# EAGLE design VA-Meter_Measure (EAGLE 7.1.0)
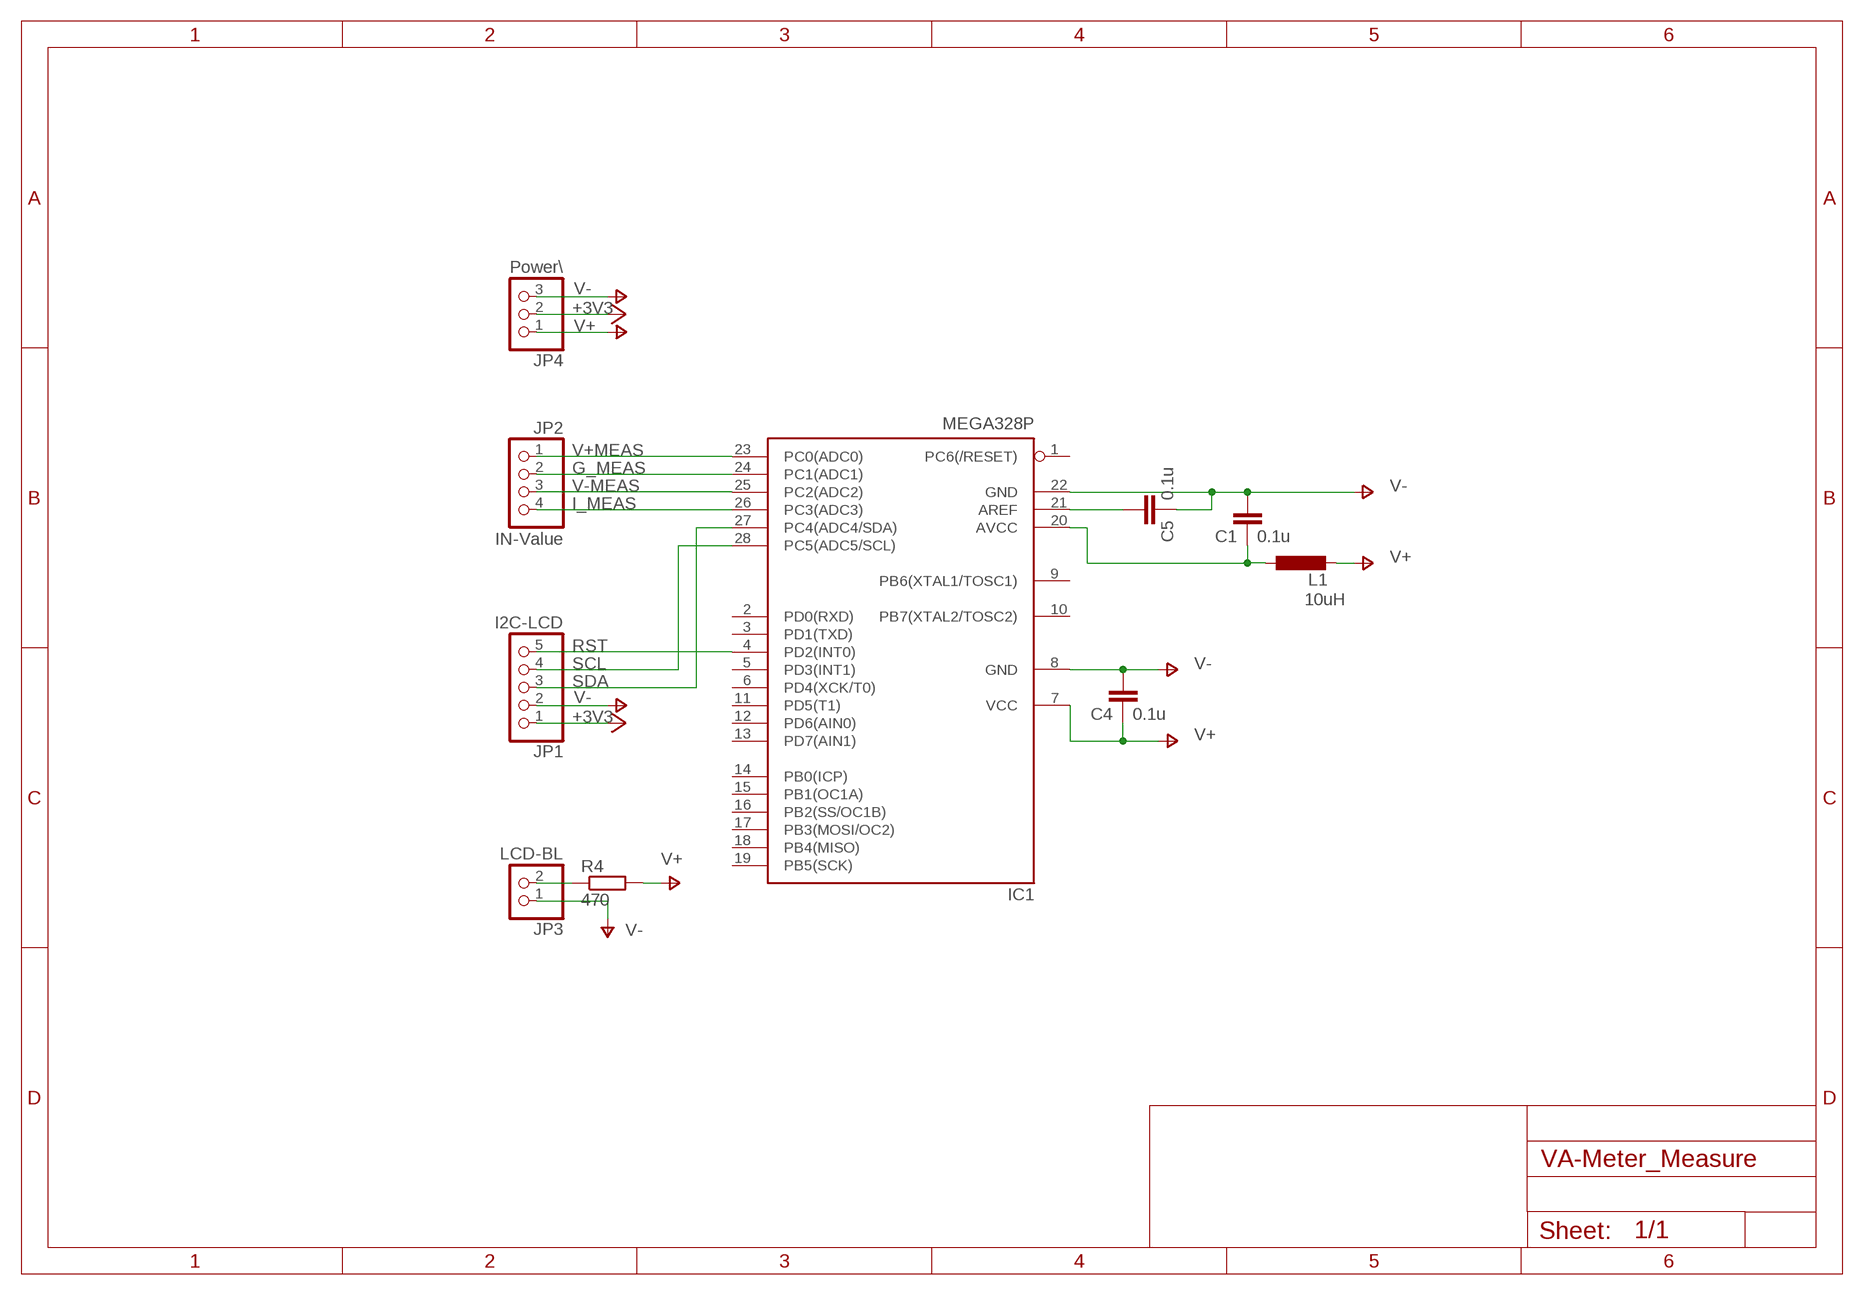
[diagram p0: schematic, sheet 1]

## Parts
C1  0.1u  C-EU050-024X044  [C050-024X044]
C4  0.1u  C-EU050-024X044  [C050-024X044]
C5  0.1u  C-EU050-024X044  [C050-024X044]
IC1  MEGA328P  [MEGA328P]
JP1  I2C-LCD  PINHD-1X5  [1X05]
JP2  IN-Value  PINHD-1X4  [1X04]
JP3  LCD-BL  PINHD-1X2  [1X02]
JP4  Power\  PINHD-1X3  [1X03]
L1  10uH  L-EU6000-XXX-RC  [6000-XXXX-RC]
R4  470  R-EU_0207/7  [0207/7]

## Nets
+3V3: JP1.1 JP4.2
G_MEAS: IC1.24(PC1(ADC1)) JP2.2
I_MEAS: IC1.26(PC3(ADC3)) JP2.4
N$2: JP3.2 R4.1
N$9: C5.2 IC1.21(AREF)
N$10: C1.1 IC1.20(AVCC) L1.1
RST: IC1.4(PD2(INT0)) JP1.5
SCL: IC1.28(PC5(ADC5/SCL)) JP1.4
SDA: IC1.27(PC4(ADC4/SDA)) JP1.3
V+: C4.1 IC1.7(VCC) JP4.1 L1.2 R4.2
V+MEAS: IC1.23(PC0(ADC0)) JP2.1
V-: C1.2 C4.2 C5.1 IC1.8(GND) IC1.22(GND) JP1.2 JP3.1 JP4.3
V-MEAS: IC1.25(PC2(ADC2)) JP2.3
Unconnected: IC1.1(PC6(/RESET)) IC1.2(PD0(RXD)) IC1.3(PD1(TXD)) IC1.5(PD3(INT1)) IC1.6(PD4(XCK/T0)) IC1.9(PB6(XTAL1/TOSC1)) IC1.10(PB7(XTAL2/TOSC2)) IC1.11(PD5(T1)) IC1.12(PD6(AIN0)) IC1.13(PD7(AIN1)) IC1.14(PB0(ICP)) IC1.15(PB1(OC1A)) IC1.16(PB2(SS/OC1B)) IC1.17(PB3(MOSI/OC2)) IC1.18(PB4(MISO)) IC1.19(PB5(SCK))

## Library data of the parts
C1 C4 C5 = rcl:C-EU: CAPACITOR, European symbol
IC1 = Mylib:MEGA328P: ATMega328P
JP1 = pinhead:PINHD-1X5: PIN HEADER
JP2 = pinhead:PINHD-1X4: PIN HEADER
JP3 = pinhead:PINHD-1X2: PIN HEADER
JP4 = pinhead:PINHD-1X3: PIN HEADER
L1 = rcl:L-EU: INDUCTOR, European symbol
R4 = rcl:R-EU_: RESISTOR, European symbol

## Board
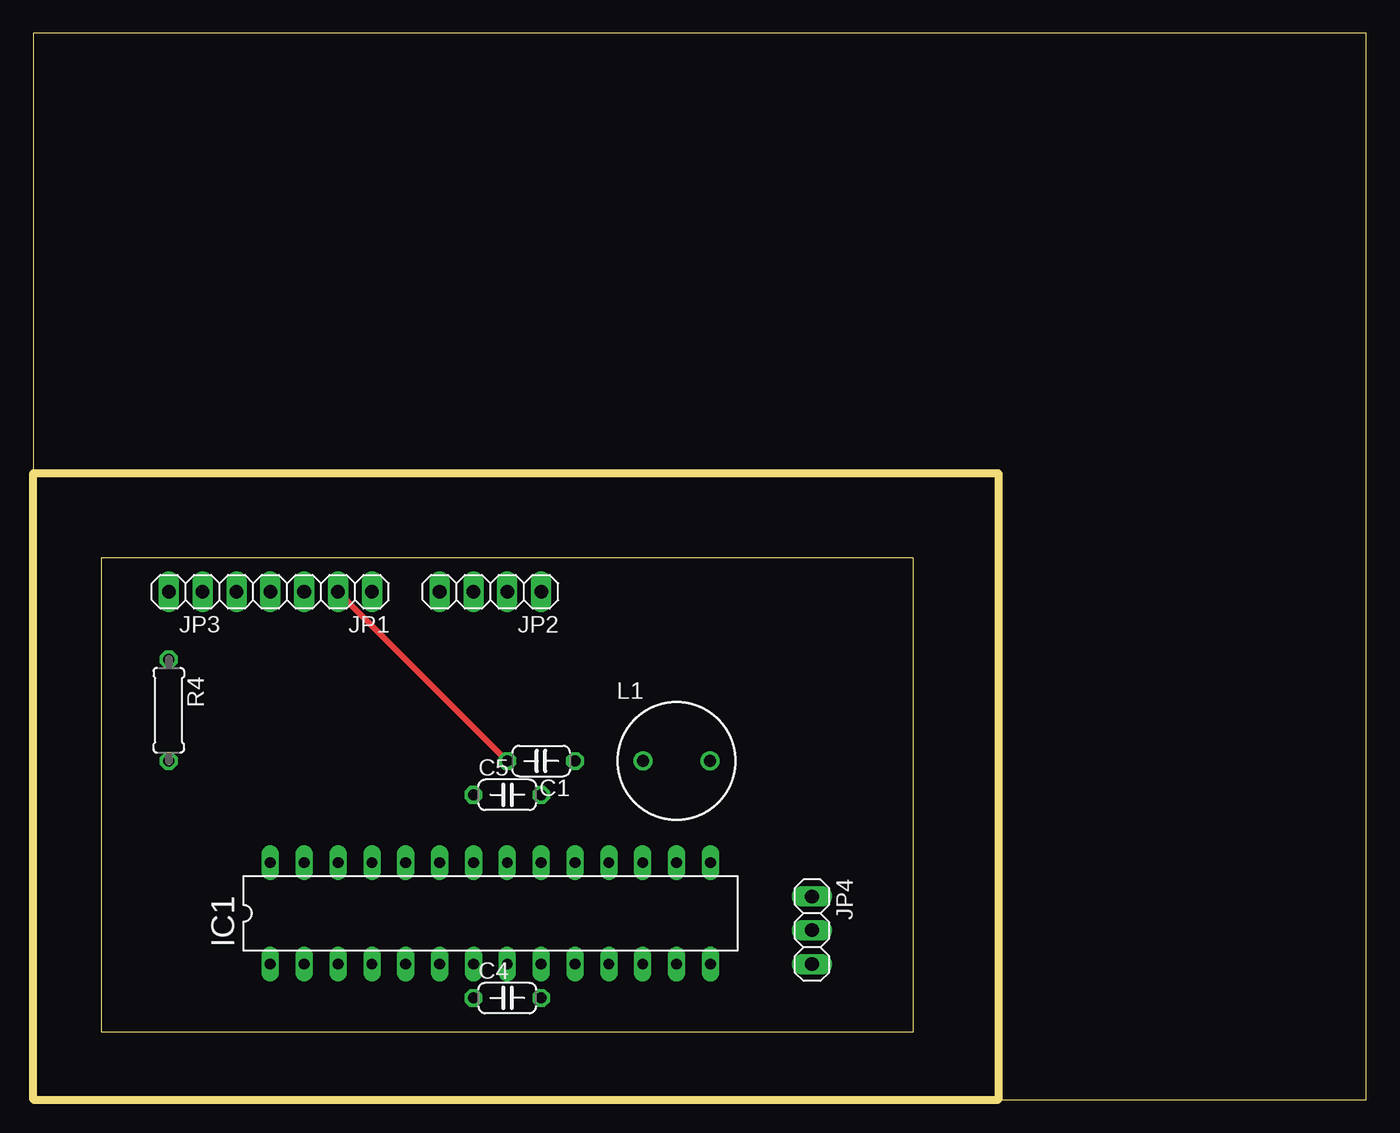
[diagram p1: board, top side]
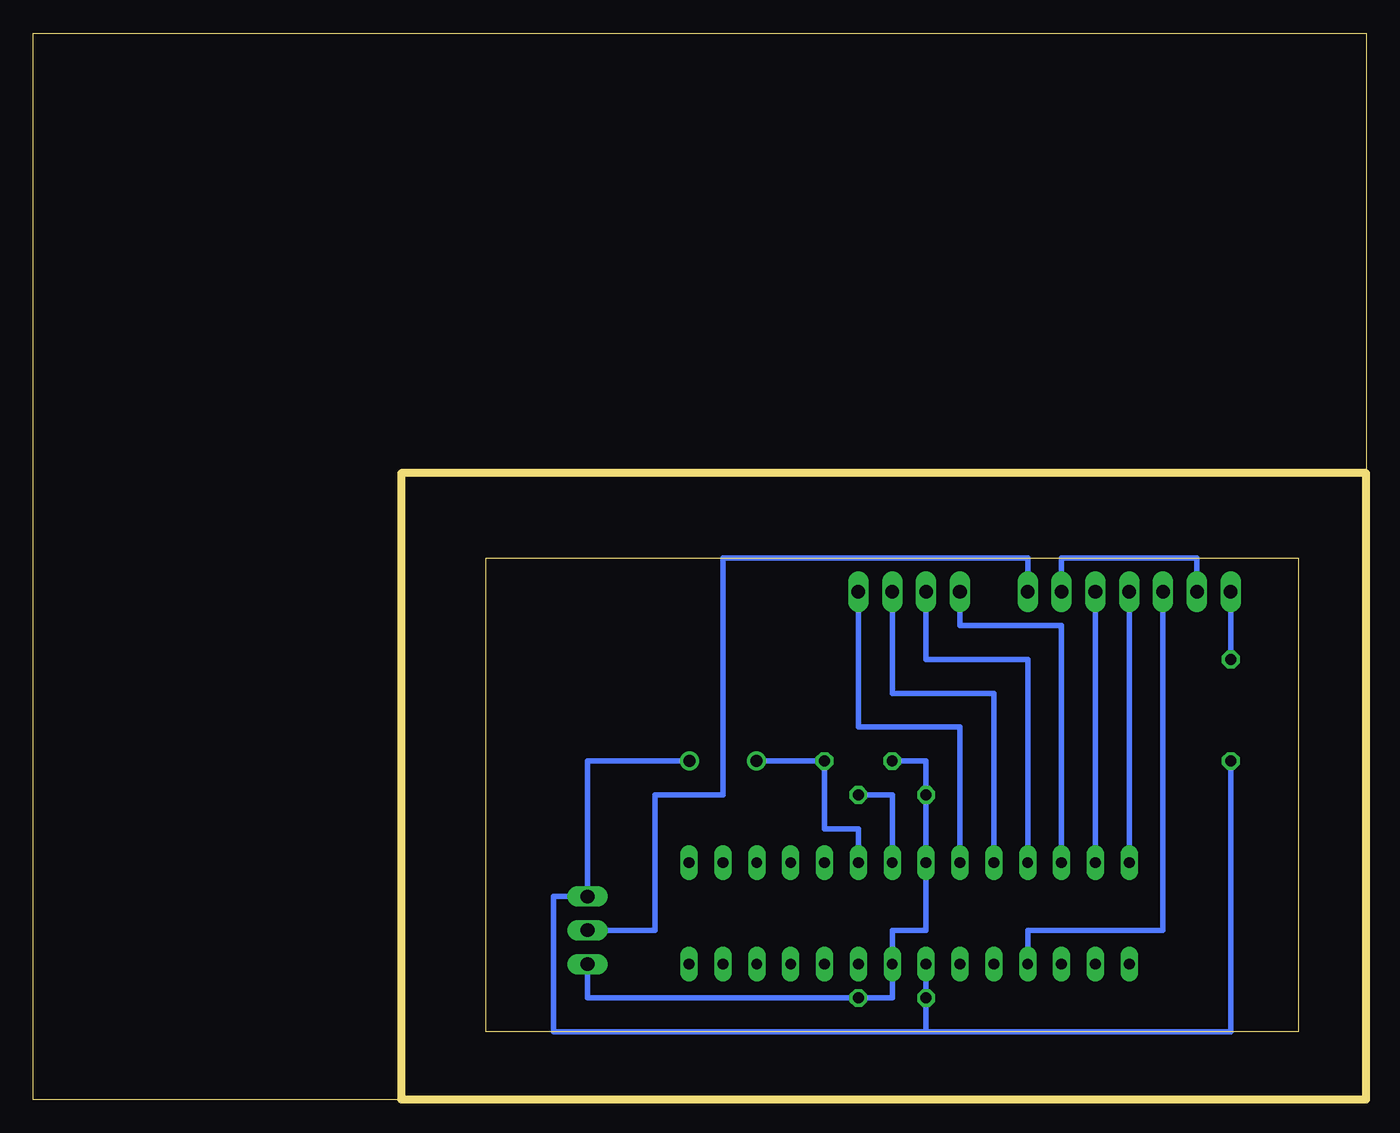
[diagram p2: board, bottom side, seen from below]

Size 100 x 80 mm. Coordinates in mm from the lower left corner, seen from the top.
Outline: 0,0 100,0 100,80 0,80 0,0
Outline: 0,0 0,46.99 72.39,46.99 72.39,0 0,0
Outline: 5.08,5.08 66.04,5.08 66.04,40.64 5.08,40.64 5.08,5.08
Copper layers (1*16): Top 0.035mm / dielectric 1.5mm / Bottom 0.035mm
Design rules "default": minimum track width 10mil, minimum drill 24mil, track to track 8mil, track to pad 8mil, pad to pad 8mil, via to via 8mil, smd to smd 8mil, copper to edge 40mil, drill to drill 8mil, minimum pad ring 10mil, minimum via ring 8mil, stop-mask expansion 4mil, vias tented up to drill 0mil, thermal gap 10mil

### Footprints (pad centres in the part's own frame; a part is rotated, then mirrored left to right if it is on the bottom)
C050-024X044 = drill 0.813 octagon: 1 -2.54,0; 2 2.54,0
MEGA328P = drill 0.813 long: 1 -15.24,-5.08; 2 -12.7,-5.08; 3 -10.16,-5.08; 4 -7.62,-5.08; 5 -5.08,-5.08; 6 -2.54,-5.08; 7 0,-5.08; 8 2.54,-5.08; 9 5.08,-5.08; 10 7.62,-5.08; 11 10.16,-5.08; 12 12.7,-5.08; 13 15.24,-5.08; 14 17.78,-5.08; 15 17.78,2.54; 16 15.24,2.54; 17 12.7,2.54; 18 10.16,2.54; 19 7.62,2.54; 20 5.08,2.54; 21 2.54,2.54; 22 0,2.54; 23 -2.54,2.54; 24 -5.08,2.54; 25 -7.62,2.54; 26 -10.16,2.54; 27 -12.7,2.54; 28 -15.24,2.54
1X05 = drill 1.016 long: 1 -5.08,0; 2 -2.54,0; 3 0,0; 4 2.54,0; 5 5.08,0
1X04 = drill 1.016 long: 1 -3.81,0; 2 -1.27,0; 3 1.27,0; 4 3.81,0
1X02 = drill 1.016 long: 1 -1.27,0; 2 1.27,0
1X03 = drill 1.016 long: 1 -2.54,0; 2 0,0; 3 2.54,0
6000-XXXX-RC = drill 0.9 pad 1.422: 1 -2.5,0; 2 2.5,0
0207/7 = drill 0.813 octagon: 1 -3.81,0; 2 3.81,0

### Placement (x,y rotation side)
C1  38.1,25.4 180 top
C4  35.56,7.62 0 top
C5  35.56,22.86 0 top
IC1  33.02,15.24 0 top
JP1  20.32,38.1 180 top
JP2  34.29,38.1 180 top
JP3  11.43,38.1 180 top
JP4  58.42,12.7 270 top
L1  48.26,25.4 0 top
R4  10.16,29.21 270 top

### Tracks (layer width: path | path; a pad name or v marks a point on that pad's centre or on a via)
+3V3
  Bottom 0.406: JP4.2 53.34,12.7 53.34,22.86 48.26,22.86 48.26,40.64 25.4,40.64 JP1.1
G_MEAS
  Bottom 0.406: IC1.24 27.94,30.48 35.56,30.48 JP2.2
I_MEAS
  Bottom 0.406: JP2.4 30.48,35.56 22.86,35.56 IC1.26
N$2
  Bottom 0.406: JP3.2 R4.1
N$9
  Bottom 0.406: C5.2 35.56,22.86 IC1.21
N$10
  Bottom 0.406: IC1.20 38.1,20.32 40.64,20.32 C1.1 L1.1
RST
  Bottom 0.406: IC1.4 25.4,12.7 15.24,12.7 JP1.5
SCL
  Bottom 0.406: JP1.4 IC1.28
SDA
  Bottom 0.406: JP1.3 IC1.27
V+
  Bottom 0.406: R4.2 10.16,5.08 33.02,5.08 | 33.02,5.08 C4.1 IC1.7 | 33.02,5.08 60.96,5.08 60.96,15.24 JP4.1 58.42,25.4 L1.2
V+MEAS
  Bottom 0.406: IC1.23 30.48,27.94 38.1,27.94 JP2.1
V-
  Top 0.406: JP1.2 C1.2
  Bottom 0.406: JP3.1 12.7,40.64 22.86,40.64 JP1.2 | JP4.3 58.42,7.62 C4.2 35.56,7.62 IC1.8 35.56,12.7 33.02,12.7 IC1.22 C5.1 33.02,25.4 C1.2
V-MEAS
  Bottom 0.406: IC1.25 25.4,33.02 33.02,33.02 JP2.3